# EAGLE design usbschalter (EAGLE 6.0)
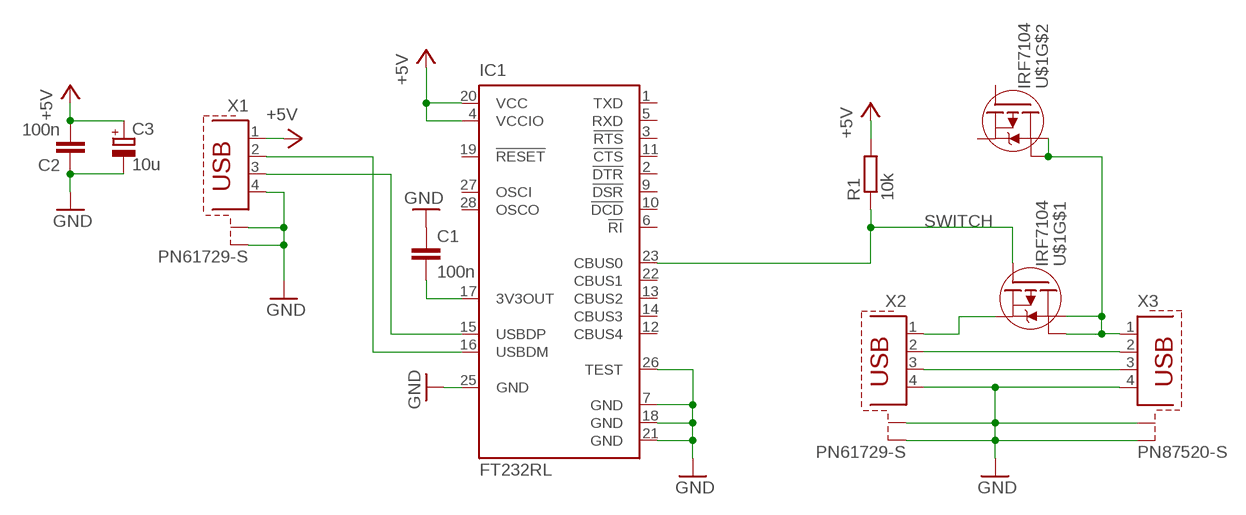
[diagram p0: schematic, sheet 1]

## Parts
C1  100n  C-EUC0805  [C0805]
C2  100n  C-EUC0805  [C0805]
C3  10u  CPOL-EUE1.8-4  [E1,8-4]
IC1  FT232RL  [SSOP28]
R1  10k  R-EU_R0805  [R0805]
U$1  IRF7104  [SO8-2]
X1  PN61729-S  [PN61729-S]
X2  PN61729-S  [PN61729-S]
X3  PN87520-S  [PN87520-S]

## Nets
+5V: C2.2 C3.+ IC1.4(VCCIO) IC1.20(VCC) R1.2 X1.1
GND: C1.1 C2.1 C3.- IC1.7(GND) IC1.18(GND) IC1.21(GND) IC1.25(GND) IC1.26(TEST) X1.4 X1.S1 X1.S2 X2.4 X2.S1 X2.S2 X3.4 X3.S1 X3.S2
N$4: X2.3 X3.3
N$5: X2.2 X3.2
N$6: U$1.1(S) X2.1
N$9: IC1.16(USBDM) X1.2
N$10: IC1.15(USBDP) X1.3
N$11: U$1.5(D) U$1.6(D) U$1.7(D) U$1.8(D) X3.1
N$12: C1.2 IC1.17(3V3OUT)
SWITCH: IC1.23(CBUS0) R1.1 U$1.2(G)
Unconnected: IC1.1(TXD) IC1.2(!DTR) IC1.3(!RTS) IC1.5(RXD) IC1.6(!RI) IC1.9(!DSR) IC1.10(!DCD) IC1.11(!CTS) IC1.12(CBUS4) IC1.13(CBUS2) IC1.14(CBUS3) IC1.19(!RESET) IC1.22(CBUS1) IC1.27(OSCI) IC1.28(OSCO) U$1.3(S) U$1.4(G)

## Library data of the parts
C1 C2 = rcl:C-EU: CAPACITOR, European symbol
C3 = rcl:CPOL-EU: POLARIZED CAPACITOR, European symbol
IC1 = ftdichip:FT232R: Source: http://www.ftdichip.com/Documents/DataSheets/DS_FT232R_v104.pdf; MPN: FT232RL; OC_FARNELL: 1146032; OC_NEWARK: 91K9918
R1 = rcl:R-EU_: RESISTOR, European symbol
U$1 = irf-2:IRF7104: HEXFET® Power MOSFET Adavanced Process Technology Ultra Low On-Resistance Dual P-Channel MOSFET Surface Mount Available in Tape & Reel Dynamic dv/dt Rating Fast Switching Please connect both Drain-Pins of each FET for thermal Reasons! (Pin 5 with Pin 6, 7 with 8)
X1 X2 = con-berg:PN61729-S: BERG USB connector; OC_FARNELL: unknown; OC_NEWARK: unknown
X3 = con-berg:PN87520-S; OC_FARNELL: unknown; OC_NEWARK: unknown

## Board
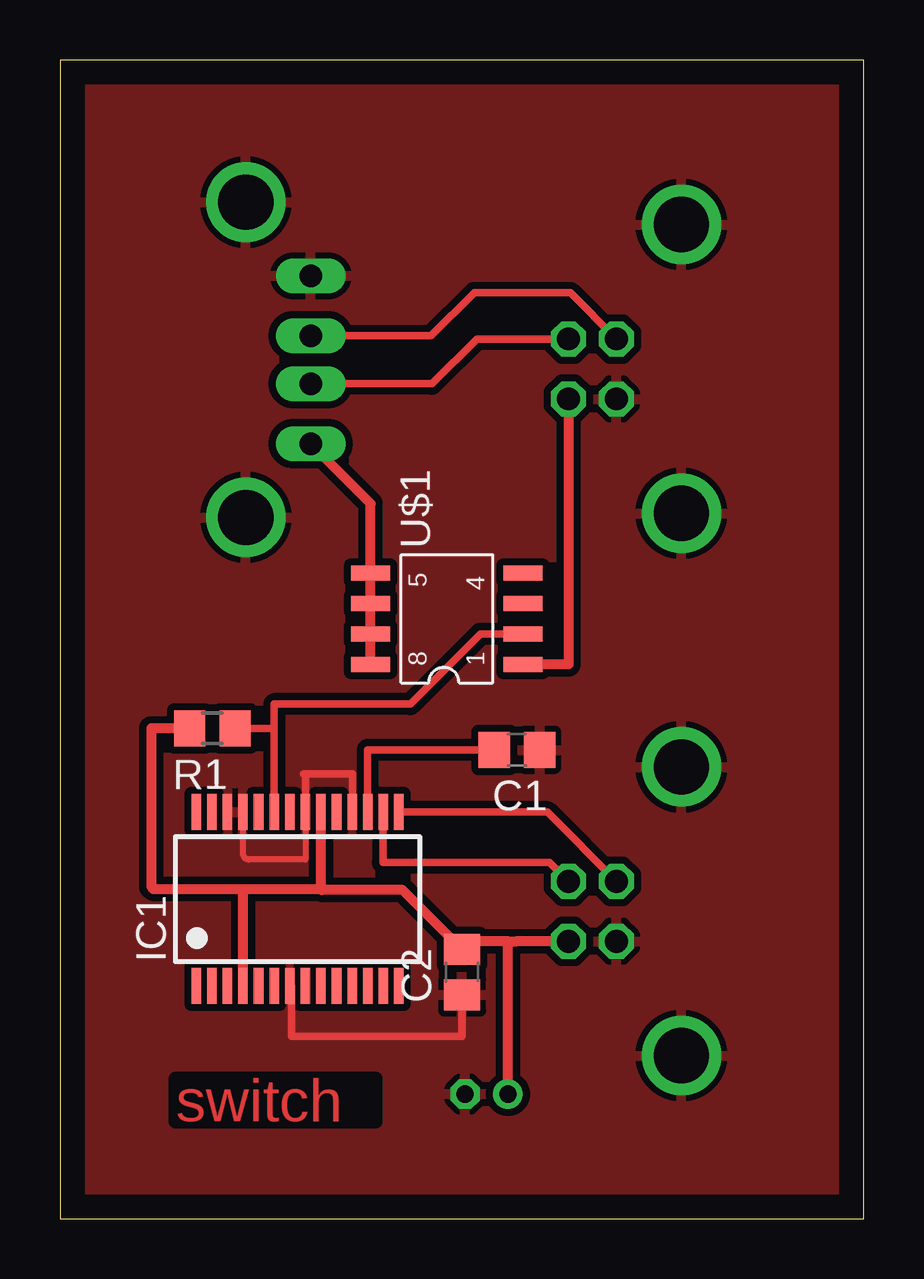
[diagram p1: board, top side]
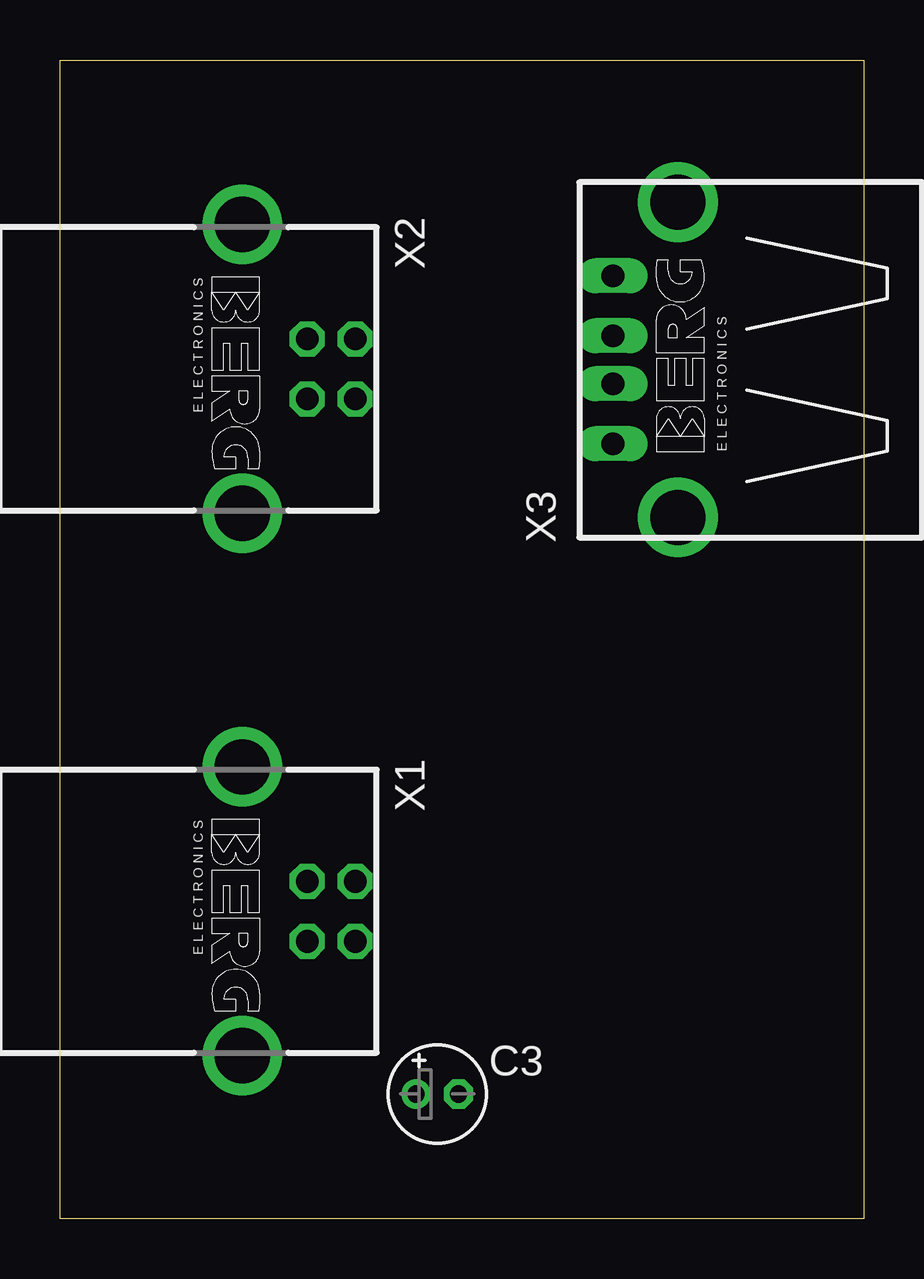
[diagram p2: board, bottom side, seen from below]

Size 33.51 x 48.31 mm. Coordinates in mm from the lower left corner, seen from the top.
Outline: 0,0 33.51,0 33.51,48.31 0,48.31 0,0
Copper layers (1*16): Top 0.035mm / dielectric 1.5mm / Bottom 0.035mm
Design rules: minimum track width 12mil, minimum drill 32mil, track to track 12mil, track to pad 12mil, pad to pad 12mil, via to via 12mil, smd to smd 12mil, copper to edge 40mil, drill to drill 10mil, minimum pad ring 10mil, minimum via ring 8mil, stop-mask expansion 4mil, vias tented up to drill 0mil, thermal gap 10mil

### Footprints (pad centres in the part's own frame; a part is rotated, then mirrored left to right if it is on the bottom)
C0805 = smd 1.3 x 1.5: 1 -0.95,0; 2 0.95,0
E1,8-4 = drill 0.711 pad 1.168: + -0.889,0 | drill 0.711 pad 1.168 octagon: - 0.889,0
SSOP28 = smd 0.4 x 1.5: 1 -4.225,-3.625; 2 -3.575,-3.625; 3 -2.925,-3.625; 4 -2.275,-3.625; 5 -1.625,-3.625; 6 -0.975,-3.625; 7 -0.325,-3.625; 8 0.325,-3.625; 9 0.975,-3.625; 10 1.625,-3.625; 11 2.275,-3.625; 12 2.925,-3.625; 13 3.575,-3.625; 14 4.225,-3.625; 15 4.225,3.625; 16 3.575,3.625; 17 2.925,3.625; 18 2.275,3.625; 19 1.625,3.625; 20 0.975,3.625; 21 0.325,3.625; 22 -0.325,3.625; 23 -0.975,3.625; 24 -1.625,3.625; 25 -2.275,3.625; 26 -2.925,3.625; 27 -3.575,3.625; 28 -4.225,3.625
R0805 = smd 1.3 x 1.5: 1 -0.95,0; 2 0.95,0
SO8-2 = smd 0.61 x 1.626: 1 -2.54,-2.54; 2 -1.27,-2.54; 3 0,-2.54; 4 1.27,-2.54; 5 1.27,3.81; 6 0,3.81; 7 -1.27,3.81; 8 -2.54,3.81
PN61729-S = drill 0.95 octagon: 1 1.25,4.71; 2 -1.25,4.71; 3 -1.25,2.71; 4 1.25,2.71 | drill 2.3 pad 2.9: S1 -6.02,0; S2 6.02,0
PN87520-S = drill 0.95 long: 1 -3.5,2.71; 2 -1,2.71; 3 1,2.71; 4 3.5,2.71 | drill 2.3 pad 2.9: S1 -6.57,0; S2 6.57,0

### Placement (x,y rotation side)
C1  19.05,19.56 180 top
C2  16.76,10.29 90 top
C3  17.78,5.21 0 bottom
IC1  9.91,13.34 0 top
R1  6.35,20.45 180 top
U$1  16.76,25.65 90 top
X1  25.91,12.83 270 bottom
X2  25.91,35.43 270 bottom
X3  7.75,35.81 90 bottom

### Tracks (layer width: path | path; a pad name or v marks a point on that pad's centre or on a via)
+5V
  Top 0.406: 10.88,13.76 10.92,13.72 14.29,13.72 C2.2 arc-90 17.1,11.58 18.67,11.58 | 10.88,13.76 IC1.20 | IC1.4 7.63,13.76 | 7.63,13.76 10.88,13.76 | R1.2 3.81,20.45 3.81,13.84 3.9,13.76 7.63,13.76 | X1.1 19.05,11.58 18.67,11.58 | C3.+ 18.67,11.58
GND
  Top 0.254: IC1.21 10.23,14.99 7.87,14.99 arc-90 7.63,15.23 IC1.25
  Top 0.305: IC1.18 12.19,16.96 12.19,18.54 10.23,18.54 | 10.16,18.54 10.23,18.54 | 10.23,18.54 IC1.21 | IC1.7 9.65,9.71 9.65,7.62 16.76,7.62 C2.1
  pour Top: -9.02,50.93 -8.89,-3.81 38.1,-3.81 37.97,50.93
N$4
  Top 0.305: X3.3 15.48,36.81 17.27,38.61 21.27,38.61 X2.3
N$5
  Top 0.305: X2.2 17.38,36.68 15.51,34.81 X3.2
N$6
  Top 0.406: X2.1 21.2,23.11 U$1.1
N$9
  Top 0.305: IC1.16 13.46,16.94 13.46,14.86 20.42,14.86 X1.2
N$10
  Top 0.305: IC1.15 20.32,16.96 X1.3
N$11
  Top 0.406: U$1.8 U$1.7 U$1.6 U$1.5 12.95,29.82 X3.1
N$12
  Top 0.305: C1.2 12.83,19.56 IC1.17
SWITCH
  Top 0.305: U$1.2 17.53,24.38 14.61,21.46 8.93,21.46 8.93,20.45 | 8.93,20.45 IC1.23 | R1.1 8.93,20.45

### Text on the board
Top: switch